# Altium schematic sheet Sheet2.SchDoc
size 420 x 297 mm
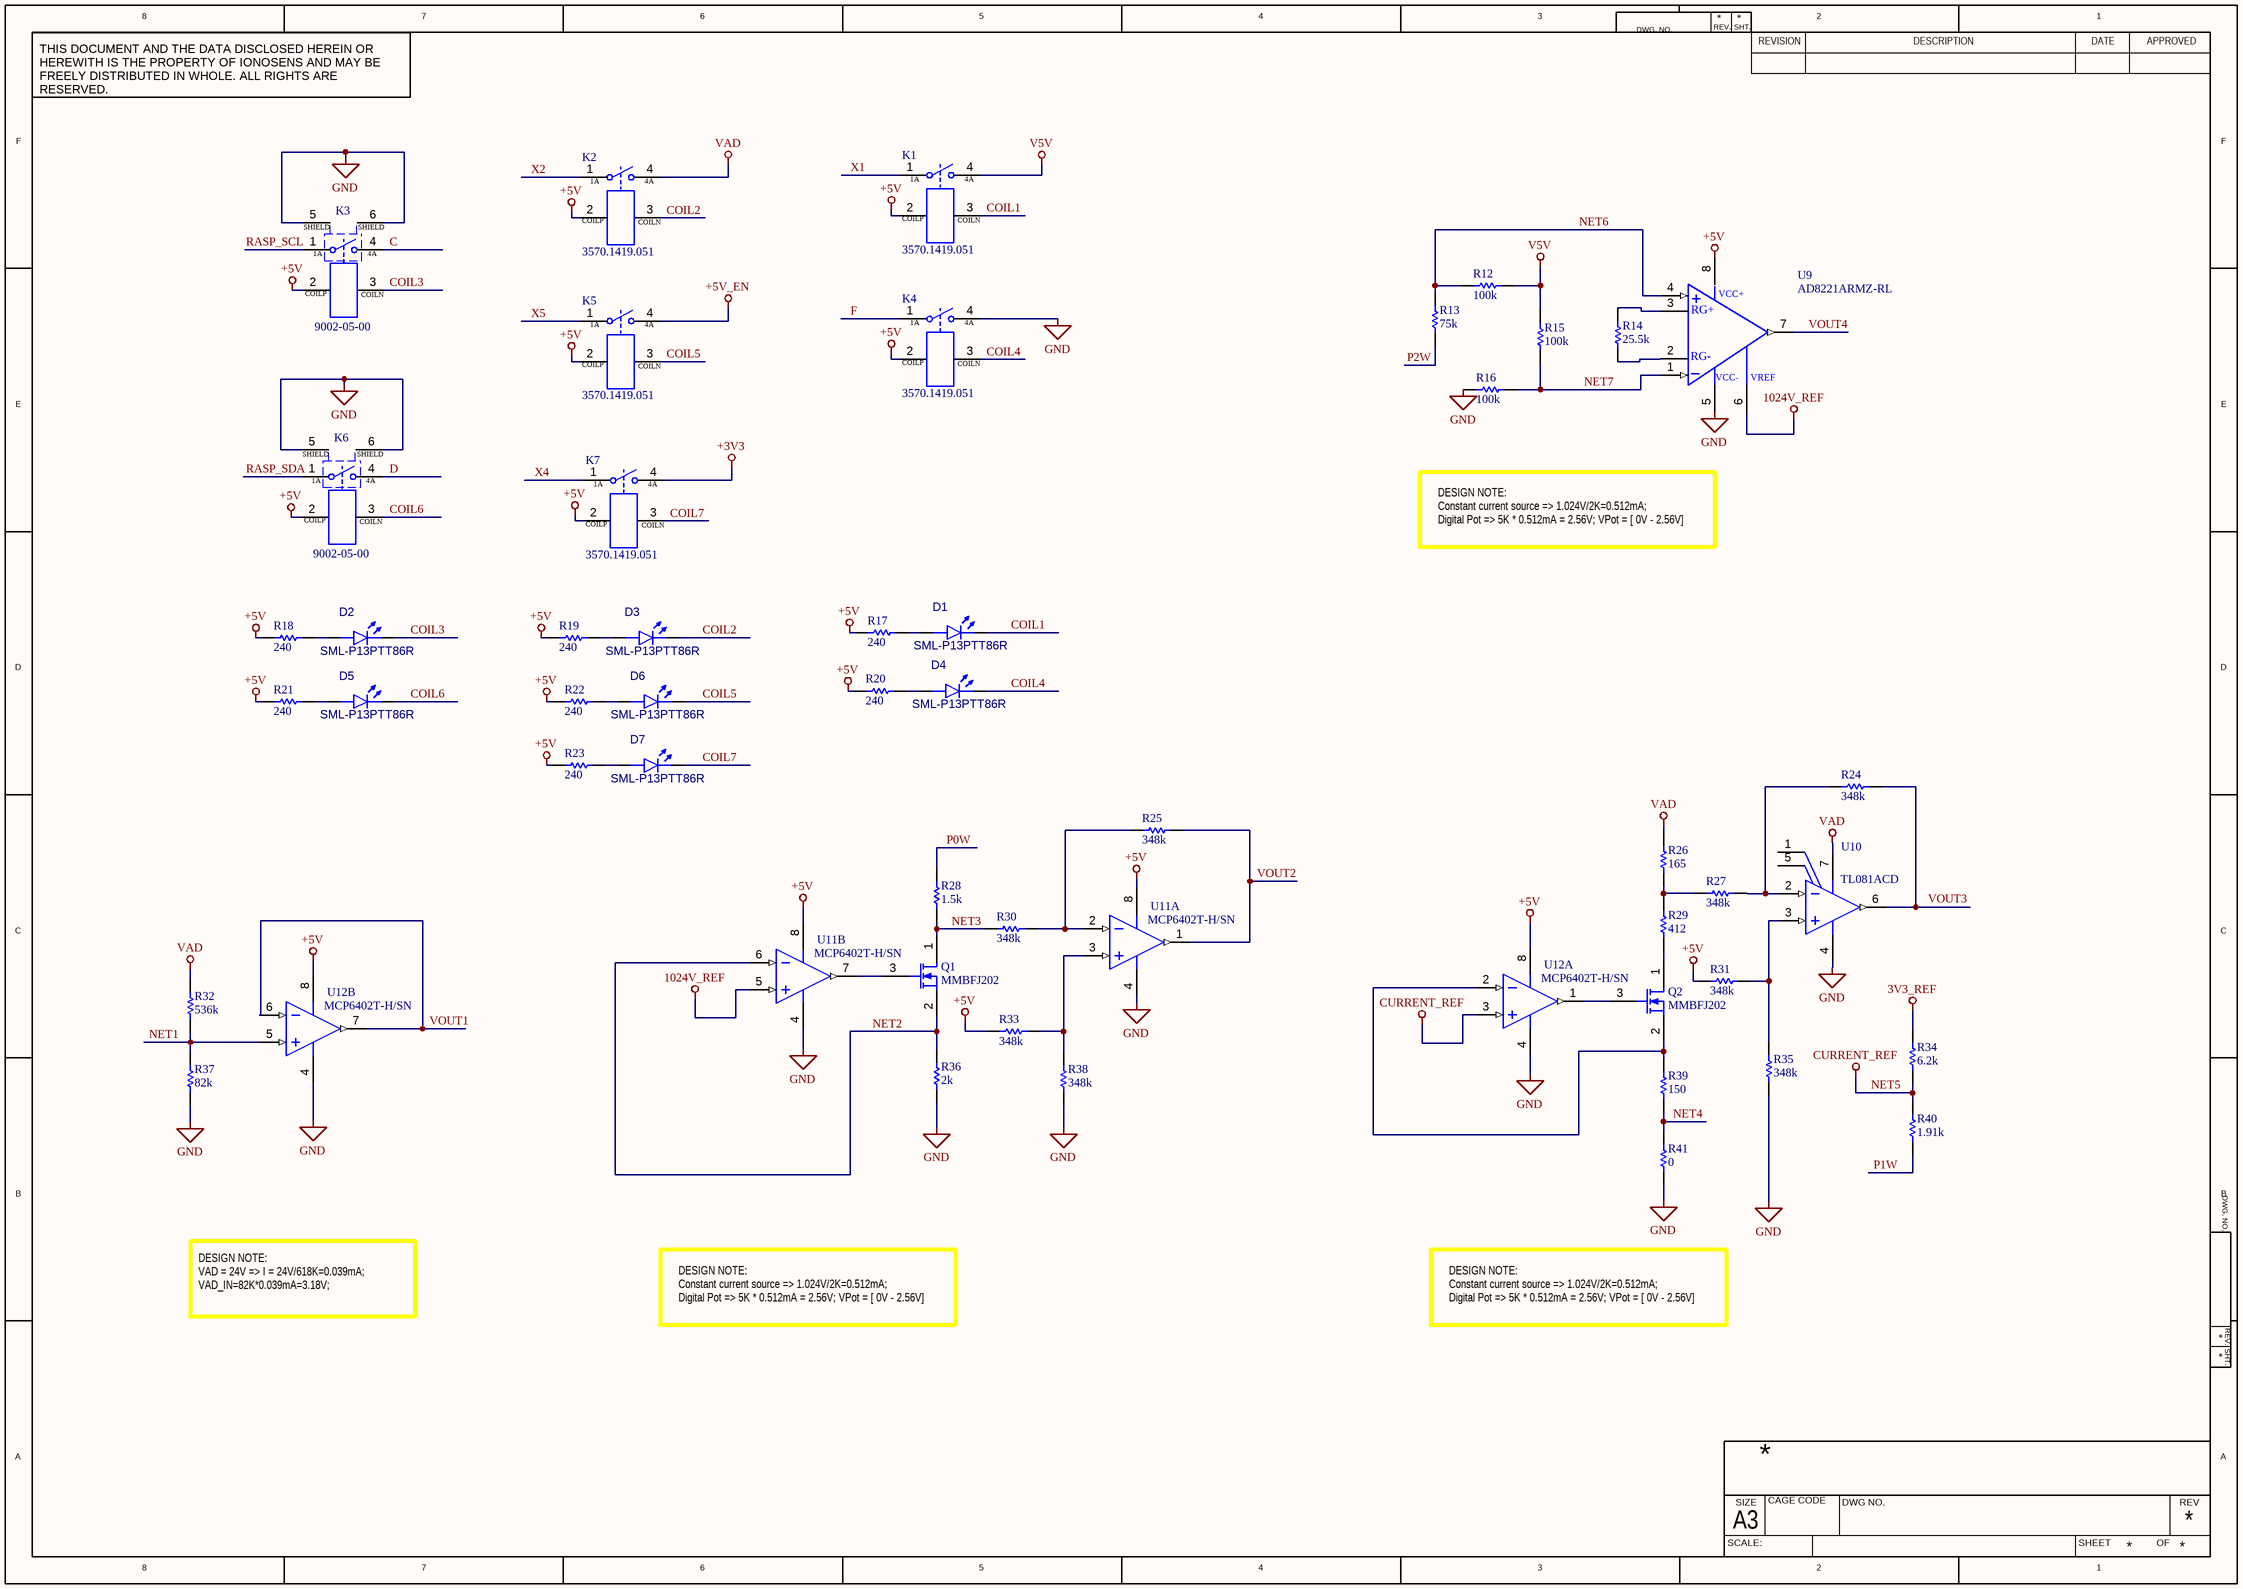
[diagram p0: Sheet2.SchDoc]

## Parts
D1  SML-P13PTT86R  [DIOC1005X02R]
D2  SML-P13PTT86R  [DIOC1005X02R]
D3  SML-P13PTT86R  [DIOC1005X02R]
D4  SML-P13PTT86R  [DIOC1005X02R]
D5  SML-P13PTT86R  [DIOC1005X02R]
D6  SML-P13PTT86R  [DIOC1005X02R]
D7  SML-P13PTT86R  [DIOC1005X02R]
K1  3570.1419.051  [3570.1419]
K2  3570.1419.051  [3570.1419]
K3  9002-05-00  [SIP564W40P254L1980H810Q6 - Cloned]
K4  3570.1419.051  [3570.1419]
K5  3570.1419.051  [3570.1419]
K6  9002-05-00  [SIP564W40P254L1980H810Q6 - Cloned]
K7  3570.1419.051  [3570.1419]
Q1  MMBFJ202  [SOT95P237X111-3M]
Q2  MMBFJ202  [SOT95P237X111-3M]
R12  value 100k  [RESC1005X04M]  (hidden comment: AC0402FR-07100KL)
R13  value 75k  [RESC1005X04M]  (hidden comment: AC0402FR-0775KL)
R14  value 25.5k  [RESC1005X04M]  (hidden comment: AC0402FR-0725K5L)
R15  value 100k  [RESC1005X04M]  (hidden comment: AC0402FR-07100KL)
R16  value 100k  [RESC1005X04M]  (hidden comment: AC0402FR-07100KL)
R17  value 240  [RESC1005X04M]  (hidden comment: AC0402FR-07240RL)
R18  value 240  [RESC1005X04M]  (hidden comment: AC0402FR-07240RL)
R19  value 240  [RESC1005X04M]  (hidden comment: AC0402FR-07240RL)
R20  value 240  [RESC1005X04M]  (hidden comment: AC0402FR-07240RL)
R21  value 240  [RESC1005X04M]  (hidden comment: AC0402FR-07240RL)
R22  value 240  [RESC1005X04M]  (hidden comment: AC0402FR-07240RL)
R23  value 240  [RESC1005X04M]  (hidden comment: AC0402FR-07240RL)
R24  value 348k  [RESC1005X04M]  (hidden comment: AC0402FR-07348KL)
R25  value 348k  [RESC1005X04M]  (hidden comment: AC0402FR-07348KL)
R26  value 165  [RESC1005X04M]  (hidden comment: AC0402FR-07165RL)
R27  value 348k  [RESC1005X04M]  (hidden comment: AC0402FR-07348KL)
R28  value 1.5k  [RESC1005X04M]  (hidden comment: AC0402FR-071K5L)
R29  value 412  [RESC1005X04M]  (hidden comment: AC0402FR-07412RL)
R30  value 348k  [RESC1005X04M]  (hidden comment: AC0402FR-07348KL)
R31  value 348k  [RESC1005X04M]  (hidden comment: AC0402FR-07348KL)
R32  value 536k  [RESC1005X04M]  (hidden comment: AC0402FR-07536KL)
R33  value 348k  [RESC1005X04M]  (hidden comment: AC0402FR-07348KL)
R34  value 6.2k  [RESC1005X04M]  (hidden comment: AC0402FR-076K2L)
R35  value 348k  [RESC1005X04M]  (hidden comment: AC0402FR-07348KL)
R36  value 2k  [RESC1005X04M]  (hidden comment: AC0402FR-072KL)
R37  value 82k  [RESC1005X04M]  (hidden comment: AC0402FR-0782KL)
R38  value 348k  [RESC1005X04M]  (hidden comment: AC0402FR-07348KL)
R39  value 150  [RESC1005X04M]  (hidden comment: AC0402FR-07150RL)
R40  value 1.91k  [RESC1005X04M]  (hidden comment: AC0402FR-071K91L)
R41  value 0  [RESC1608X06M]  (hidden comment: AC0603FR-070RL)
U9  AD8221ARMZ-RL  [TSOP65P490X110-8N]
U10  TL081ACD  [SOIC127P600X175-8M]
U11  MCP6402T-H/SN  [SOIC127P600X175-8M]  (parts A,B of 2)
U12  MCP6402T-H/SN  [SOIC127P600X175-8M]  (parts A,B of 2)

## Nets
3V3_REF: R34.2
1024V_REF: U9.6(VREF) U11.5(2IN+)
+3V3: K7.4(4A)
+5V: K1.2(COILP) K2.2(COILP) K3.2(COILP) K4.2(COILP) K5.2(COILP) K6.2(COILP) K7.2(COILP) R17.1 R18.1 R19.1 R20.1 R21.1 R22.1 R23.1 R31.1 R33.1 U9.8(VDD) U11.8(VCC) U12.8(VCC)
+5V_EN: K5.4(4A)
GND: K3.5(Shield) K3.6(Shield) K4.4(4A) K6.5(Shield) K6.6(Shield) R16.1 R35.1 R36.1 R37.1 R38.1 R41.1 U9.5(VSS) U10.4(VSS) U11.4(GND) U12.4(GND)
NET5: R34.1 R40.2 U12.3(1IN+)  [also labelled CURRENT_REF]
V5V: K1.4(4A) R12.2 R15.2
VAD: K2.4(4A) R26.2 R32.2 U10.7(VDD)
C: K3.4(4A)
COIL1: D1.1(K) K1.3(COILN)
COIL2: D3.1(K) K2.3(COILN)
COIL3: D2.1(K) K3.3(COILN)
COIL4: D4.1(K) K4.3(COILN)
COIL5: D6.1(K) K5.3(COILN)
COIL6: D5.1(K) K6.3(COILN)
COIL7: D7.1(K) K7.3(COILN)
D: K6.4(4A)
F: K4.1(1A)
NET1: R32.1 R37.2 U12.5(2IN+)
NET2: Q1.2(S) R36.2 U11.6(2IN-)
NET3: Q1.1(D) R28.1 R30.1
NET4: R39.1 R41.2
NET6: R12.1 R13.2 U9.4(VIN+)
NET7: R15.1 R16.2 U9.1(VIN-)
P0W: R28.2
P1W: R40.1
P2W: R13.1
RASP_SCL: K3.1(1A)
RASP_SDA: K6.1(1A)
VOUT1: U12.6(2IN-) U12.7(2OUT)
VOUT2: R25.2 U11.1(1OUT)
VOUT3: R24.2 U10.6(VOUT)
VOUT4: U9.7(VOUT)
X1: K1.1(1A)
X2: K2.1(1A)
X4: K7.1(1A)
X5: K5.1(1A)
NetD1_2: D1.2(A) R17.2
NetD2_2: D2.2(A) R18.2
NetD3_2: D3.2(A) R19.2
NetD4_2: D4.2(A) R20.2
NetD5_2: D5.2(A) R21.2
NetD6_2: D6.2(A) R22.2
NetD7_2: D7.2(A) R23.2
NetQ1_3: Q1.3(G) U11.7(2OUT)
NetQ2_1: Q2.1(D) R29.1
NetQ2_2: Q2.2(S) R39.2 U12.2(1IN-)
NetQ2_3: Q2.3(G) U12.1(1OUT)
NetR14_1: R14.1 U9.2(RG-)
NetR14_2: R14.2 U9.3(RG+)
NetR24_1: R24.1 R27.2 U10.2(VIN-)
NetR25_1: R25.1 R30.2 U11.2(1IN-)
NetR26_1: R26.1 R27.1 R29.2
NetR31_2: R31.2 R35.2 U10.3(VIN+)
NetR33_2: R33.2 R38.2 U11.3(1IN+)

Not connected (* = marked no-connect by the designer): U10 1(OFFSET_N1) 5(OFFSET_N2)

## Notes on the sheet
- DESIGN NOTE:
  Constant current source => 1.024V/2K=0.512mA;         Digital Pot => 5K * 0.512mA = 2.56V; VPot = [ 0V - 2.56V]
- DESIGN NOTE:
  VAD = 24V => I = 24V/618K=0.039mA; VAD_IN=82K*0.039mA=3.18V;
- 8
- 7
- 6
- 5
- 4
- 3
- DWG. NO.
- REV.
- SHT.
- REVISION
- 2
- DESCRIPTION
- DATE
- 1
- APPROVED
- THIS DOCUMENT AND THE DATA DISCLOSED HEREIN OR HEREWITH IS THE PROPERTY OF IONOSENS AND MAY BE FREELY DISTRIBUTED IN WHOLE. ALL RIGHTS ARE RESERVED.
- F
- E
- D
- C
- B
- A
- SCALE:
- A3
- SIZE
- CAGE CODE
- DWG NO.
- SHEET
- OF
- REV
- (in symbol CMP-014-00003-2) VCC+; VCC-
- (in symbol K01-0008-01-00002-6) SHIELD

## Library data of the parts
D1-D7 = D01-0402-01-00000-1: Led green 0402; Manufacturer: ROHM; Forward Voltage: 2.1V; Max Power Dissipation: 52mW; Forward Current: 20 mA; Number of LEDs: 1; Dominant Wavelength: 560 nm; Luminous Intensity: 10 mcd; Lens Style: Rectangular, Square; Min Operating Temperature: -40°C; Mounting Technology: SMD; Colour: Green; Manufacturer P/N: SML-P13PTT86R; Max Operating Temperature: 85°C; Pins: 2; RoHS Compliant: Yes; Case/Package: 0402
K1 K2 K4 K5 K7 = K01-0008-01-00008-1: Reed Relay, Mini SIP, 5 VDC; 1 Form A, 15W, 200 VDC, 1.25A; Manufacturer: Comus; Number of Terminal: 4; Contact Current Rating: 1A; Coil Current: 10mA; Switching Voltage: 200V; Rise time: 0s; Contact Resistence: 0.15; Coil resitence: 500; Operate Time: 350µs; Coil Voltage (DC): 5V; Insulation Resistance: 0; Release Time: 100µs; Manufacturer P/N: 3570.1419.051; Mounting Technology: TH; Contact Material: -; Relay Type: Reed; Width: 15.24mm; Contact Form: 1A; Packaging: SIP; Switching Current: 1A; Pins: 4; Case/Package: SIP; Coil Type: -; Min Operating Temperature: -40°C; RoHS: Yes; Height: 6.98mm; Max Operating Temperature: 85°C
K3 K6 = K01-0008-01-00002-6: Reed Relay 5VDC 350Ohm 0.5A SPST-NO THT; Manufacturer: COTO; Rise time: 350µs; Coil Current: 14.28mA; Release Time: 100µs; Number of Terminal: 6; Contact Form: SPST; Insulation Resistance: 1T; Coil Type: Non-Latching; Coil Voltage (DC): 5V; Contact Current Rating: 500mA; Contact Resistence: 0.2; Switching Voltage: 200V; Coil resitence: 350; Relay Type: RF; Mounting Technology: Through Hole; Case/Package: SIP; Contact Material: Ruthenium; Packaging: Bulk; Width: 19.3mm; Height: 7.6mm; Max Operating Temperature: 85°C; RoHS: Yes; Min Operating Temperature: -20°C; Pins: 6; Switching Current: 500mA; Operate Time: 350µs; Manufacturer P/N: 9002-05-00
Q1 Q2 = CMP-013-00036-1: MMBFJ202 Series 40 V 4.5 mA N-Channel General Purpose Amplifier - SOT-23; Manufacturer: Semi on; Power: 350mW; Vgs (Max): -40V; Transistor Type: Mosfet Channel N; Case/Package: SOT-23; Pins: 3; Mounting Technology: SMD; Manufacturer P/N: MMBFJ202; Max Operating Temperature: 150°C; Min Operating Temperature: -55°C; Vgs(th) (Max) @ Id: -; RoHS Compliant: yes
R12 R15 R16 = R01-0402-01-00360-2: RES SMD 100K OHM 1% 1/16W 0402; Manufacturer: Yageo; Voltage Rating: 50V; Power Rating: 62.5mW; Temperature Coefficient: 100 ppm/ºC; Manufacturer P/N: AC0402FR-07100KL; Packaging: Tape & Reel; Features: Automotive AEC-Q200, Moisture Resistant; Width: 508µm; RoHS: Yes; Height: 370µm; Number of Terminations: 2; Min Operating Temperature: -55°C; Max Operating Temperature: 155°C; Length: 990.6µm; Composition: Thick Film; Case/Package: 0402; Tolerance: 1%
R13 = R01-0402-01-00337-2: RES SMD 75K OHM 1% 1/16W 0402; Manufacturer: Yageo; Temperature Coefficient: 100 ppm/ºC; Power Rating: 62.5mW; Voltage Rating: 50V; Features: Automotive AEC-Q200, Moisture Resistant; Composition: Thick Film; Width: 508µm; Length: 990.6µm; Number of Terminations: 2; Tolerance: 1%; Min Operating Temperature: -55°C; RoHS: Yes; Height: 370µm; Manufacturer P/N: AC0402FR-0775KL; Max Operating Temperature: 155°C; Packaging: Tape & Reel; Case/Package: 0402
R14 = R01-0402-01-00237-2: RES SMD 25.5K OHM 1% 1/16W 0402; Manufacturer: Yageo; Power Rating: 62.5mW; Voltage Rating: 50V; Temperature Coefficient: 100 ppm/ºC; Composition: Thick Film; Width: 508µm; Number of Terminations: 2; Case/Package: 0402; RoHS: Yes; Height: 370µm; Tolerance: 1%; Packaging: Tape & Reel; Min Operating Temperature: -55°C; Max Operating Temperature: 155°C; Length: 990.6µm; Manufacturer P/N: AC0402FR-0725K5L; Features: Automotive AEC-Q200, Moisture Resistant
R17-R23 = R01-0402-01-00437-2: RES SMD 240 OHM 1% 1/16W 0402; Manufacturer: Yageo; Temperature Coefficient: 100 ppm/ºC; Power Rating: 62.5mW; Voltage Rating: 50V; Packaging: Tape & Reel; Manufacturer P/N: AC0402FR-07240RL; Height: 370µm; Case/Package: 0402; Composition: Thick Film; Max Operating Temperature: 155°C; Number of Terminations: 2; RoHS: Yes; Min Operating Temperature: -55°C; Tolerance: 1%; Width: 508µm; Length: 990.6µm; Features: Automotive AEC-Q200, Moisture Resistant
R24 R25 R27 R30 R31 R33 R35 R38 = R01-0402-01-00475-2: RES SMD 348K OHM 1% 1/16W 0402; Manufacturer: Yageo; Temperature Coefficient: 100 ppm/ºC; Voltage Rating: 50V; Power Rating: 62.5mW; Features: Automotive AEC-Q200, Moisture Resistant; Number of Terminations: 2; Case/Package: 0402; Packaging: Tape & Reel; Height: 370µm; Width: 508µm; RoHS: Yes; Manufacturer P/N: AC0402FR-07348KL; Composition: Thick Film; Max Operating Temperature: 155°C; Min Operating Temperature: -55°C; Tolerance: 1%; Length: 990.6µm
R26 = R01-0402-01-00404-2: RES SMD 165 OHM 1% 1/16W 0402; Manufacturer: Yageo; Power Rating: 62.5mW; Voltage Rating: 50V; Temperature Coefficient: 100 ppm/ºC; Width: 508µm; Max Operating Temperature: 155°C; Manufacturer P/N: AC0402FR-07165RL; Case/Package: 0402; Height: 370µm; Number of Terminations: 2; Tolerance: 1%; Min Operating Temperature: -55°C; RoHS: Yes; Length: 990.6µm; Features: Automotive AEC-Q200, Moisture Resistant; Packaging: Tape & Reel; Composition: Thick Film
R28 = R01-0402-01-00008-7: RES SMD 1.5K OHM 1% 1/16W 0402; Manufacturer: Yageo; Voltage Rating: 50V; Temperature Coefficient: 100 ppm/ºC; Power Rating: 62.5mW; Number of Terminations: 2; Packaging: Tape & Reel; Case/Package: 0402; Tolerance: 1%; Height: 370µm; Min Operating Temperature: -55°C; RoHS: Yes; Features: Automotive AEC-Q200, Moisture Resistant; Composition: Thick Film; Max Operating Temperature: 155°C; Width: 508µm; Length: 990.6µm; Manufacturer P/N: AC0402FR-071K5L
R29 = R01-0402-01-00492-2: RES SMD 412 OHM 1% 1/16W 0402; Manufacturer: Yageo; Temperature Coefficient: 100 ppm/ºC; Power Rating: 62.5mW; Voltage Rating: 50V; Tolerance: 1%; Features: Automotive AEC-Q200, Moisture Resistant; Length: 990.6µm; Case/Package: 0402; Composition: Thick Film; Min Operating Temperature: -55°C; RoHS: Yes; Packaging: Tape & Reel; Manufacturer P/N: AC0402FR-07412RL; Width: 508µm; Max Operating Temperature: 155°C; Number of Terminations: 2; Height: 370µm
R32 = R01-0402-01-00517-2: RES SMD 536K OHM 1% 1/16W 0402; Manufacturer: Yageo; Voltage Rating: 50V; Power Rating: 62.5mW; Temperature Coefficient: 100 ppm/ºC; Features: Automotive AEC-Q200, Moisture Resistant; Length: 990.6µm; Number of Terminations: 2; Max Operating Temperature: 155°C; RoHS: Yes; Composition: Thick Film; Case/Package: 0402; Width: 508µm; Manufacturer P/N: AC0402FR-07536KL; Packaging: Tape & Reel; Tolerance: 1%; Height: 370µm; Min Operating Temperature: -55°C
R34 = R01-0402-01-00133-2: RES SMD 6.2K OHM 1% 1/16W 0402; Manufacturer: Yageo; Power Rating: 62.5mW; Voltage Rating: 50V; Temperature Coefficient: 100 ppm/ºC; Max Operating Temperature: 155°C; Min Operating Temperature: -55°C; Packaging: Tape & Reel; Composition: Thick Film; Manufacturer P/N: AC0402FR-076K2L; Case/Package: 0402; Width: 508µm; Features: Automotive AEC-Q200, Moisture Resistant; RoHS: Yes; Tolerance: 1%; Height: 370µm; Length: 990.6µm; Number of Terminations: 2
R36 = R01-0402-01-00067-3: RES SMD 2K OHM 1% 1/16W 0402; Manufacturer: Yageo; Voltage Rating: 50V; Power Rating: 62.5mW; Temperature Coefficient: 100 ppm/ºC; Tolerance: 1%; Length: 990.6µm; Width: 508µm; Number of Terminations: 2; Packaging: Tape & Reel; Composition: Thick Film; RoHS: Yes; Height: 370µm; Case/Package: 0402; Manufacturer P/N: AC0402FR-072KL; Features: Automotive AEC-Q200, Moisture Resistant; Min Operating Temperature: -55°C; Max Operating Temperature: 155°C
R37 = R01-0402-01-00345-2: RES SMD 82K OHM 1% 1/16W 0402; Manufacturer: Yageo; Temperature Coefficient: 100 ppm/ºC; Voltage Rating: 50V; Power Rating: 62.5mW; Width: 508µm; RoHS: Yes; Length: 990.6µm; Max Operating Temperature: 155°C; Features: Automotive AEC-Q200, Moisture Resistant; Composition: Thick Film; Packaging: Tape & Reel; Min Operating Temperature: -55°C; Number of Terminations: 2; Height: 370µm; Manufacturer P/N: AC0402FR-0782KL; Case/Package: 0402; Tolerance: 1%
R39 = R01-0402-01-00394-2: RES SMD 150 OHM 1% 1/16W 0402; Manufacturer: Yageo; Voltage Rating: 50V; Temperature Coefficient: 100 ppm/ºC; Power Rating: 62.5mW; Number of Terminations: 2; RoHS: Yes; Packaging: Tape & Reel; Features: Automotive AEC-Q200, Moisture Resistant; Width: 508µm; Manufacturer P/N: AC0402FR-07150RL; Min Operating Temperature: -55°C; Height: 370µm; Composition: Thick Film; Length: 990.6µm; Tolerance: 1%; Case/Package: 0402; Max Operating Temperature: 155°C
R40 = R01-0402-01-00027-2: RES SMD 1.91K OHM 1% 1/16W 0402; Manufacturer: Yageo; Temperature Coefficient: 100 ppm/ºC; Voltage Rating: 50V; Power Rating: 62.5mW; Features: Automotive AEC-Q200, Moisture Resistant; Width: 508µm; Manufacturer P/N: AC0402FR-071K91L; Tolerance: 1%; Packaging: Tape & Reel; RoHS: Yes; Composition: Thick Film; Min Operating Temperature: -55°C; Max Operating Temperature: 155°C; Case/Package: 0402; Height: 370µm; Length: 990.6µm; Number of Terminations: 2
R41 = R01-0603-01-00000-4: RES SMD 0 OHM 1% 1/10W 0603; Manufacturer: Yageo; Power Rating: 100mW; Temperature Coefficient: 200 ppm/ºC; Voltage Rating1: 75V; Voltage Rating: 50V; Number of Terminations: 2; Length: 1.6002µm; Composition: Thick Film; Min Operating Temperature: -55°C; Max Operating Temperature: 155°C; Width: 800µm; Height: 550µm; Case/Package: 0603; RoHS: Yes; Manufacturer P/N: AC0603FR-070RL; Tolerance: 1%; Features: Automotive AEC-Q200, Moisture Resistant; Packaging: Tape & Reel
U9 = CMP-014-00003-2: Amp INSTR Amp Single ±18V 8-Pin MSOP; Manufacturer: Analog; Channels: 1; Power: 200mW; Min Supply Voltage: 2.3V; Max Supply Voltage: 36V; Max Operating Temperature: 85°C; Mounting Technology: SMD; Output Type: -; Case/Package: MSOP; Manufacturer P/N: AD8221ARMZ-RL; Min Operating Temperature: -40°C; Pins: 8; RoHS Compliant: yes
U10 = CMP-014-00004-1: Single JFET-input improved offset operational amplifier 8-SOIC 0 to 70; Manufacturer: Texas Instrument; Power: 680mW; Max Supply Voltage: 30V; Output Type: FET; Channels: 1; Min Supply Voltage: 3.5V; Pins: 8; Max Operating Temperature: 70°C; RoHS Compliant: yes; Mounting Technology: SMD; Manufacturer P/N: TL081ACD; Case/Package: SOIC8; Min Operating Temperature: 0°C
U11 U12 = CMP-014-00002-1: Op Amp Dual GP R-R I/O 6V Automotive 8-Pin SOIC; Manufacturer: Microchip; Min Supply Voltage: 1.8V; Channels: 2; Case/Package: SOIC; Manufacturer P/N: MCP6402T-H/SN; Output Type: -; Max Supply Voltage: 6V; Mounting Technology: SMD; Max Operating Temperature: 150°C; Min Operating Temperature: -40°C; RoHS Compliant: yes; Pins: 8